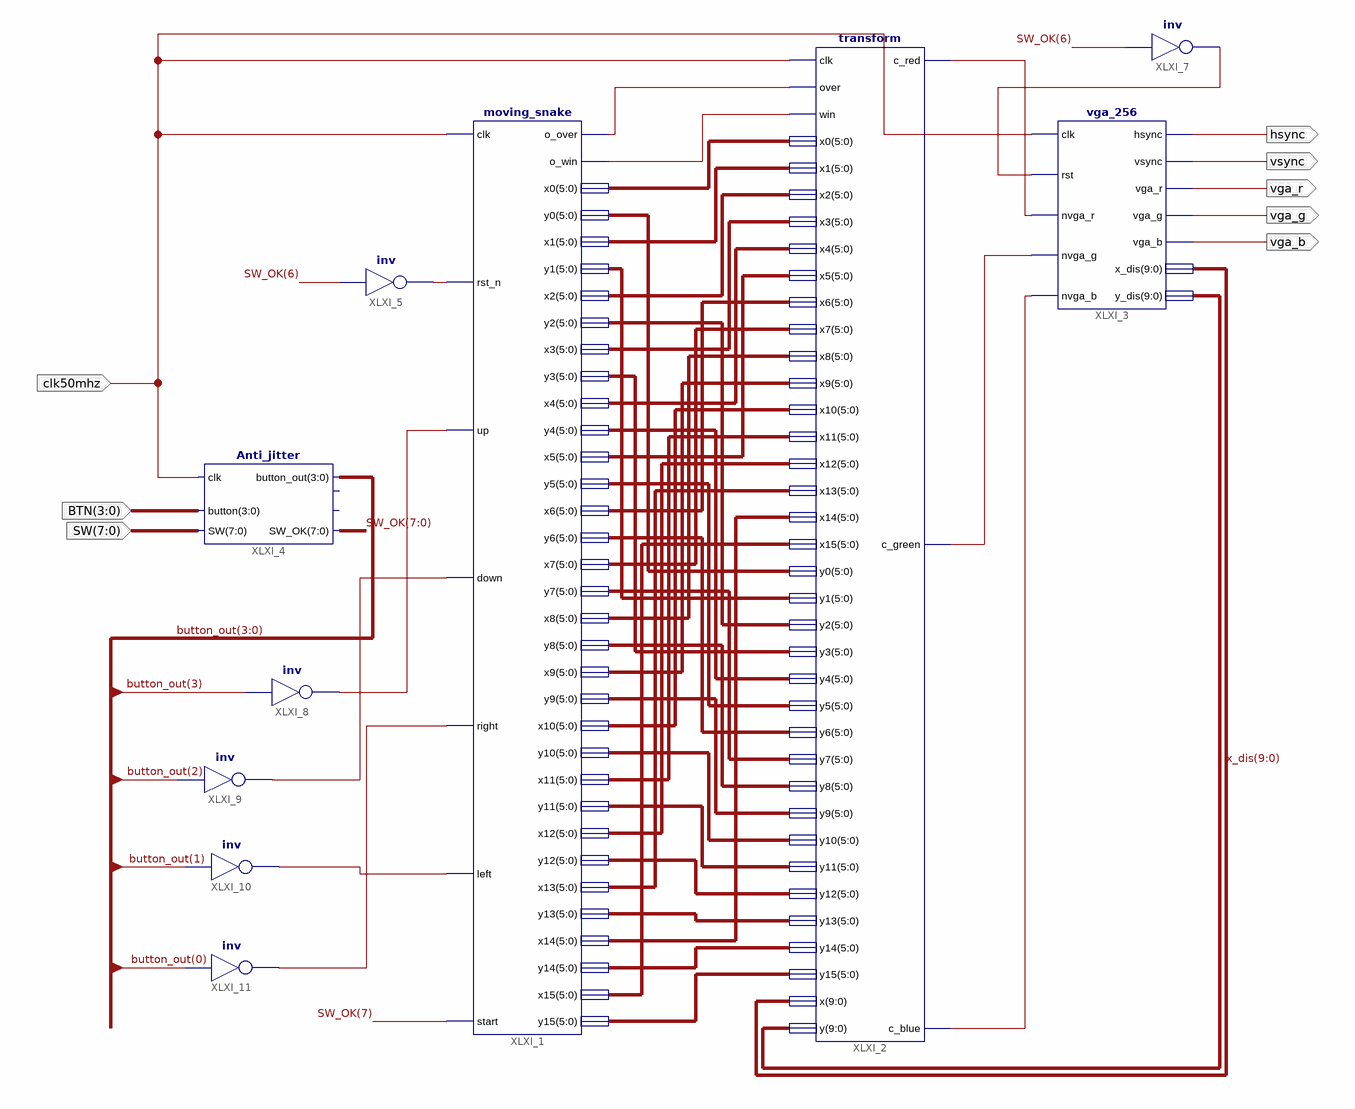
[diagram p0: schematic sheet 1]
// Xilinx ISE schematic Top_snake.sch (spartan3) as structural Verilog: 10 symbols, 8 ports
module Top_snake (
  input  clk50mhz,
  input  [3:0] BTN,
  input  [7:0] SW,
  output hsync,
  output vsync,
  output vga_b,
  output vga_r,
  output vga_g
);

  wire XLXN_15, XLXN_16, XLXN_17, XLXN_21, XLXN_22, XLXN_47, XLXN_49, XLXN_54, XLXN_58, XLXN_61, XLXN_62;
  wire [3:0] button_out;
  wire [5:0] x0, x1, x2, x3, x4, x5, x6, x7, x8, x9, x10, x11, x12, x13, x14, x15, y0, y1, y2, y3, y4, y5,
       y6, y7, y8, y9, y10, y11, y12, y13, y14, y15;
  wire [7:0] SW_OK;
  wire [9:0] x_dis, XLXN_46;

  transform XLXI_2 (
    .clk(clk50mhz), .over(XLXN_21), .win(XLXN_22), .x0(x0), .x1(x1), .x2(x2), .x3(x3), .x4(x4), .x5(x5),
    .x6(x6), .x7(x7), .x8(x8), .x9(x9), .x10(x10), .x11(x11), .x12(x12), .x13(x13), .x14(x14), .x15(x15),
    .y0(y0), .y1(y1), .y2(y2), .y3(y3), .y4(y4), .y5(y5), .y6(y6), .y7(y7), .y8(y8), .y9(y9), .y10(y10),
    .y11(y11), .y12(y12), .y13(y13), .y14(y14), .y15(y15), .x(x_dis), .y(XLXN_46), .c_red(XLXN_15),
    .c_green(XLXN_16), .c_blue(XLXN_17));
  vga_256 XLXI_3 (
    .clk(clk50mhz), .rst(XLXN_49), .nvga_r(XLXN_15), .nvga_g(XLXN_16), .nvga_b(XLXN_17), .hsync(hsync),
    .vsync(vsync), .vga_r(vga_r), .vga_g(vga_g), .vga_b(vga_b), .x_dis(x_dis), .y_dis(XLXN_46));
  Anti_jitter XLXI_4 (
    .clk(clk50mhz), .SW(SW), .button(BTN), .button_out(button_out), .SW_OK(SW_OK));  // open: rst, button_pulse
  not XLXI_5 (XLXN_47, SW_OK[6]);
  not XLXI_7 (XLXN_49, SW_OK[6]);
  moving_snake XLXI_1 (
    .clk(clk50mhz), .rst_n(XLXN_47), .up(XLXN_54), .down(XLXN_58), .right(XLXN_61), .left(XLXN_62),
    .start(SW_OK[7]), .o_over(XLXN_21), .o_win(XLXN_22), .x0(x0), .y0(y0), .x1(x1), .y1(y1), .x2(x2),
    .y2(y2), .x3(x3), .y3(y3), .x4(x4), .y4(y4), .x5(x5), .y5(y5), .x6(x6), .y6(y6), .x7(x7), .y7(y7),
    .x8(x8), .y8(y8), .x9(x9), .y9(y9), .x10(x10), .y10(y10), .x11(x11), .y11(y11), .x12(x12), .y12(y12),
    .x13(x13), .y13(y13), .x14(x14), .y14(y14), .x15(x15), .y15(y15));
  not XLXI_8 (XLXN_54, button_out[3]);
  not XLXI_9 (XLXN_58, button_out[2]);
  not XLXI_10 (XLXN_62, button_out[1]);
  not XLXI_11 (XLXN_61, button_out[0]);
endmodule
